# EAGLE schematic emonTx4-PiZero (EAGLE 9.6.2)
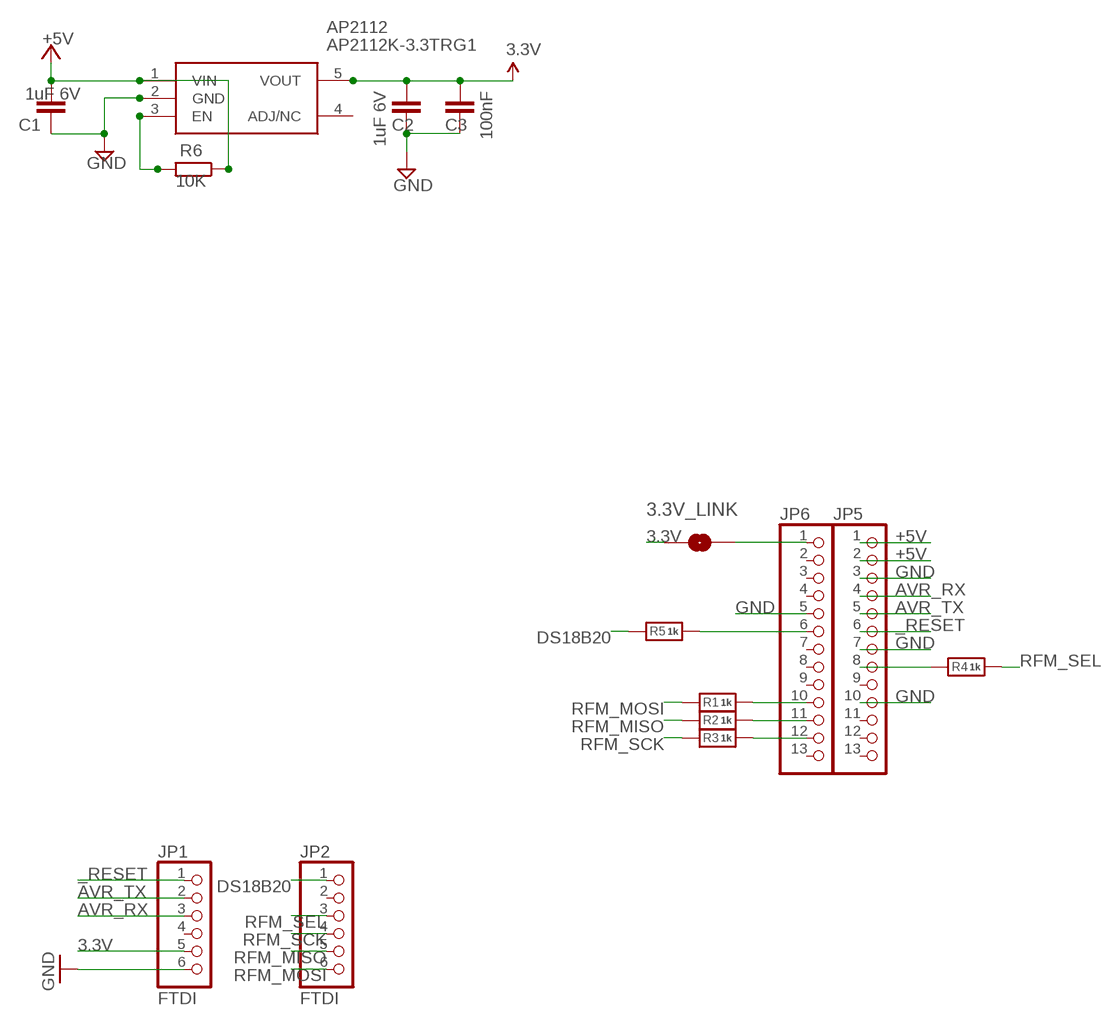
[diagram p0: schematic, sheet 1]

## Parts
3.3V_LINK  SOLDERJUMPERNC  [SJ_2S]
AP2112  AP2112K-3.3TRG1  [SOT95P282X130-5N]
C1  1uF 6V  C-EUC0603  [C0603]
C2  1uF 6V  C-EUC0603  [C0603]
C3  100nF  C-EUC0603  [C0603]
JP1  FTDI  HEADER-1X670MIL  [1X06_ROUND_70]
JP2  FTDI  HEADER-1X670MIL  [1X06_ROUND_70]
JP5  PINHD-1X13_BIG  [1X13-BIG]
JP6  PINHD-1X13_BIG  [1X13-BIG]
R1  1k  RESISTOR_0603  [_0603]
R2  1k  RESISTOR_0603  [_0603]
R3  1k  RESISTOR_0603  [_0603]
R4  1k  RESISTOR_0603  [_0603]
R5  1k  RESISTOR_0603  [_0603]
R6  10K  R-EU_R0603  [R0603]

## Nets
3.3V: 3.3V_LINK.1 AP2112.5(VOUT) C2.2 C3.2 JP1.5
+5V [power]: AP2112.1(VIN) C1.2 JP5.1 JP5.2 R6.1
_RESET: JP1.1 JP5.6
AVR_RX: JP1.3 JP5.4
AVR_TX: JP1.2 JP5.5
DS18B20: JP2.1 R5.2
GND: AP2112.2(GND) C1.1 C2.1 C3.1 JP1.6 JP5.3 JP5.7 JP5.10 JP6.5
N$1: JP5.8 R4.2
N$2: JP6.6 R5.1
N$3: 3.3V_LINK.2 JP6.1
N$10: JP6.10 R1.1
N$11: JP6.11 R2.1
N$12: JP6.12 R3.1
N$25: AP2112.3(EN) R6.2
RFM_MISO: JP2.5 R2.2
RFM_MOSI: JP2.6 R1.2
RFM_SCK: JP2.4 R3.2
RFM_SEL: JP2.3 R4.1
Unconnected: AP2112.4(ADJ/NC) JP1.4 JP2.2 JP5.9 JP5.11 JP5.12 JP5.13 JP6.2 JP6.3 JP6.4 JP6.7 JP6.8 JP6.9 JP6.13

## Library data of the parts
3.3V_LINK = SparkFun:SOLDERJUMPER: Solder Jumper Standard SMD solder jumper. Used to automate production. Two varients : Normally Open and Normally Closed are the same, but have different paste layers. NC will have a large amount of paste and should jumper during reflow.
AP2112 = AP2112K-3.3TRG1:AP2112K-3.3TRG1: 600mA 3.3V LDO Regulator Enable SOT23-5 DiodesZetex AP2112K-3.3TRG1, LDO Voltage Regulator, 3.3 V +/-1.5%, 2.5 6 Vin, 5-Pin SOT-23 Source: Datasheet <http://uk.rs-online.com/web/p/products/8283509>; ARROW_PART_NUMBER: AP2112K-3.3TRG1; ARROW_PRICE-STOCK: https://www.arrow.com/en/products/ap2112k-3.3trg1/diodes-incorporated?region=nac; DESCRIPTION: 600mA 3.3V LDO Regulator Enable SOT23-5 DiodesZetex AP2112K-3.3TRG1, LDO Voltage Regulator, 3.3 V +/-1.5%, 2.5 6 Vin, 5-Pin SOT-23; HEIGHT: 1.3mm; MANUFACTURER_NAME: Diodes Inc.; MANUFACTURER_PART_NUMBER: AP2112K-3.3TRG1; MOUSER_PART_NUMBER: 621-AP2112K-3.3TRG1; MOUSER_PRICE-STOCK: https://www.mouser.co.uk/ProductDetail/Diodes-Incorporated/AP2112K-33TRG1?qs=x6A8l6qLYDDPYHosCdzh%2FA%3D%3D
C1-C3 = resistor:C-EU: CAPACITOR, European symbol
JP1 JP2 = microbuilder:HEADER-1X6: PIN HEADER
JP5 JP6 = adafruit:PINHD-1X13: PIN HEADER
R1-R5 = microbuilder:RESISTOR: Resistors For new designs, use the packages preceded by an '_' character since they are more reliable: The following footprints should be used on most boards: _0402 - Standard footprint for regular board layouts _0603 - Standard footprint for regular board layouts _0805 - Standard footprint for regular board layouts _1206 - Standard footprint for regular board layouts For extremely tight-pitch boards where space is at a premium, the following 'micro-pitch' footprints can be used (smaller pads, no silkscreen outline, etc.): _0402MP - Micro-pitch footprint for very dense/compact boards _0603MP - Micro-pitch footprint for very dense/compact boards _0805MP - Micro-pitch footprint for very dense/compact boards _1206MP - Micro-pitch footprint for very dense/compact boards
R6 = rcl:R-EU_: RESISTOR, European symbol

## Net classes
1 power: width 0.254 mm, drill 0.5 mm, clearance 0.152 mm
2 gnd: width 0.254 mm, drill 0.5 mm, clearance 0.152 mm